# Altium schematic sheet SoM.SchDoc: SoM TE0720
size 420 x 297 mm; Author: P. Zdunek; DrawnBy: P. Zdunek; DocumentNumber: 2; SheetNumber: 2; SheetTotal: 37; ModifiedBy: -; CheckedDate: -; Title2: Fast Stabilizer; DivGrp: WUT ISE; Designer: G.Kasprowicz
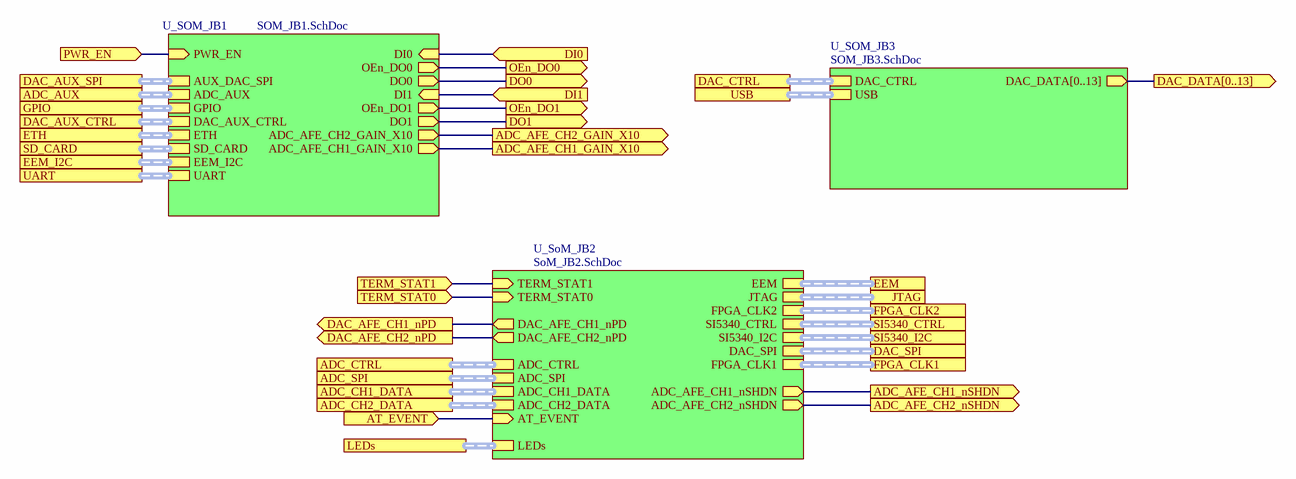
[diagram p0: SoM.SchDoc]

## Sub-sheets
U_SOM_JB1 = SOM_JB1.SchDoc: ETH (harness ETH), SD_CARD (harness SD_CARD), EEM_I2C (harness EEM_I2C), UART (harness UART), DAC_AUX_CTRL (harness DAC_AUX_CTRL), DI0 (in), ADC_AUX (harness ADC_AUX), ADC_AFE_CH1_GAIN_X10 (out), GPIO (harness GPIO), AUX_DAC_SPI (harness DAC_AUX_SPI), ADC_AFE_CH2_GAIN_X10 (out), DI1 (in), OEn_DO0 (out), DO0 (out), OEn_DO1 (out), DO1 (out), PWR_EN (in)
U_SoM_JB2 = SoM_JB2.SchDoc: JTAG (harness JTAG), EEM (harness EEM), TERM_STAT0 (in), TERM_STAT1 (in), DAC_AFE_CH2_nPD (out), DAC_AFE_CH1_nPD (out), ADC_CTRL (harness LTC2195_CTRL), ADC_CH2_DATA (harness LTC2195_DATA), ADC_SPI (harness LTC2195_SPI), ADC_CH1_DATA (harness LTC2195_DATA), FPGA_CLK2 (harness DIFFCLK), AT_EVENT (in), ADC_AFE_CH2_nSHDN (out), SI5340_I2C (harness I2C), DAC_SPI (harness AD9117_DAC_SPI), FPGA_CLK1 (harness DIFFCLK), ADC_AFE_CH1_nSHDN (out), SI5340_CTRL (harness SI5340_CTRL), LEDs (harness LEDs)
U_SOM_JB3 = SOM_JB3.SchDoc: DAC_DATA[0..13] (out), USB (harness USB), DAC_CTRL (harness AD9117_DAC_CTRL)

## Ports
ADC_AFE_CH1_GAIN_X10 (out), ADC_AFE_CH1_nSHDN (out), ADC_AFE_CH2_GAIN_X10 (out), ADC_AFE_CH2_nSHDN (out), ADC_AUX (harness ADC_AUX), ADC_CH1_DATA (harness LTC2195_DATA), ADC_CH2_DATA (harness LTC2195_DATA), ADC_CTRL (harness LTC2195_CTRL), ADC_SPI (harness LTC2195_SPI), AT_EVENT (in), DAC_AFE_CH1_nPD (out), DAC_AFE_CH2_nPD (out), DAC_AUX_CTRL (harness DAC_AUX_CTRL), DAC_AUX_SPI (harness DAC_AUX_SPI), DAC_CTRL (harness AD9117_DAC_CTRL), DAC_DATA[0..13] (out), DAC_SPI (harness AD9117_DAC_SPI), DI0 (in), DI1 (in), DO0 (out), DO1 (out), EEM (harness EEM), EEM_I2C (harness EEM_I2C), ETH (harness ETH), FPGA_CLK1 (harness DIFFCLK), FPGA_CLK2 (harness DIFFCLK), GPIO (harness GPIO), JTAG (harness JTAG), LEDs (harness LEDs), OEn_DO0 (out), OEn_DO1 (out), PWR_EN (in), SD_CARD (harness SD_CARD), SI5340_CTRL (harness SI5340_CTRL), SI5340_I2C (harness I2C), TERM_STAT0 (in), TERM_STAT1 (in), UART (harness UART), USB (harness USB)

## Nets
ADC_AFE_CH1_GAIN_X10: port ADC_AFE_CH1_GAIN_X10, sheet U_SOM_JB1/ADC_AFE_CH1_GAIN_X10
ADC_AFE_CH1_nSHDN: port ADC_AFE_CH1_nSHDN, sheet U_SoM_JB2/ADC_AFE_CH1_nSHDN
ADC_AFE_CH2_GAIN_X10: port ADC_AFE_CH2_GAIN_X10, sheet U_SOM_JB1/ADC_AFE_CH2_GAIN_X10
ADC_AFE_CH2_nSHDN: port ADC_AFE_CH2_nSHDN, sheet U_SoM_JB2/ADC_AFE_CH2_nSHDN
AT_EVENT: port AT_EVENT, sheet U_SoM_JB2/AT_EVENT
DAC_AFE_CH1_nPD: port DAC_AFE_CH1_nPD, sheet U_SoM_JB2/DAC_AFE_CH1_nPD
DAC_AFE_CH2_nPD: port DAC_AFE_CH2_nPD, sheet U_SoM_JB2/DAC_AFE_CH2_nPD
DI0: port DI0, sheet U_SOM_JB1/DI0
DI1: port DI1, sheet U_SOM_JB1/DI1
DO0: port DO0, sheet U_SOM_JB1/DO0
DO1: port DO1, sheet U_SOM_JB1/DO1
OEn_DO0: port OEn_DO0, sheet U_SOM_JB1/OEn_DO0
OEn_DO1: port OEn_DO1, sheet U_SOM_JB1/OEn_DO1
PWR_EN: port PWR_EN, sheet U_SOM_JB1/PWR_EN
TERM_STAT0: port TERM_STAT0, sheet U_SoM_JB2/TERM_STAT0
TERM_STAT1: port TERM_STAT1, sheet U_SoM_JB2/TERM_STAT1

## Buses and harness runs
bus port DAC_DATA[0..13] = sheet U_SOM_JB3/DAC_DATA[0..13]
harness port ADC_AUX = sheet U_SOM_JB1/ADC_AUX
harness port ADC_CH1_DATA = sheet U_SoM_JB2/ADC_CH1_DATA
harness port ADC_CH2_DATA = sheet U_SoM_JB2/ADC_CH2_DATA
harness port ADC_CTRL = sheet U_SoM_JB2/ADC_CTRL
harness port ADC_SPI = sheet U_SoM_JB2/ADC_SPI
harness port DAC_AUX_CTRL = sheet U_SOM_JB1/DAC_AUX_CTRL
harness port DAC_AUX_SPI = sheet U_SOM_JB1/AUX_DAC_SPI
harness port DAC_CTRL = sheet U_SOM_JB3/DAC_CTRL
harness port DAC_SPI = sheet U_SoM_JB2/DAC_SPI
harness port EEM = sheet U_SoM_JB2/EEM
harness port EEM_I2C = sheet U_SOM_JB1/EEM_I2C
harness port ETH = sheet U_SOM_JB1/ETH
harness port FPGA_CLK1 = sheet U_SoM_JB2/FPGA_CLK1
harness port FPGA_CLK2 = sheet U_SoM_JB2/FPGA_CLK2
harness port GPIO = sheet U_SOM_JB1/GPIO
harness port JTAG = sheet U_SoM_JB2/JTAG
harness port LEDs = sheet U_SoM_JB2/LEDs
harness port SD_CARD = sheet U_SOM_JB1/SD_CARD
harness port SI5340_CTRL = sheet U_SoM_JB2/SI5340_CTRL
harness port SI5340_I2C = sheet U_SoM_JB2/SI5340_I2C
harness port UART = sheet U_SOM_JB1/UART
harness port USB = sheet U_SOM_JB3/USB

## Notes on the sheet
- Project/Equipment
- Document
- Designer
- Drawn by
- Check.by
- Copyright WUT ISE 2020.
  This documentation describes Open Hardware and is licensed under the CERN OHL v.1.2. You may redistribute and modify this documentation under the terms of the CERN OHL v.1.2. (http://ohwr.org/CERNOHL). This documentation is distributed WITHOUT ANY EXPRESS OR IMPLIED WARRANTY, INCLUDING OF MERCHANTABILITY, SATISFACTORY QUALITY AND FITNESS FOR A PARTICULAR PURPOSE. Please see the CERN OHL v.1.2 for applicable conditions.
- Contact
- File
- Last Mod.
- Print Date
- Sheet
- Size
- A3
- of
- Rev